# EAGLE design air-sense (EAGLE 8.4.0)
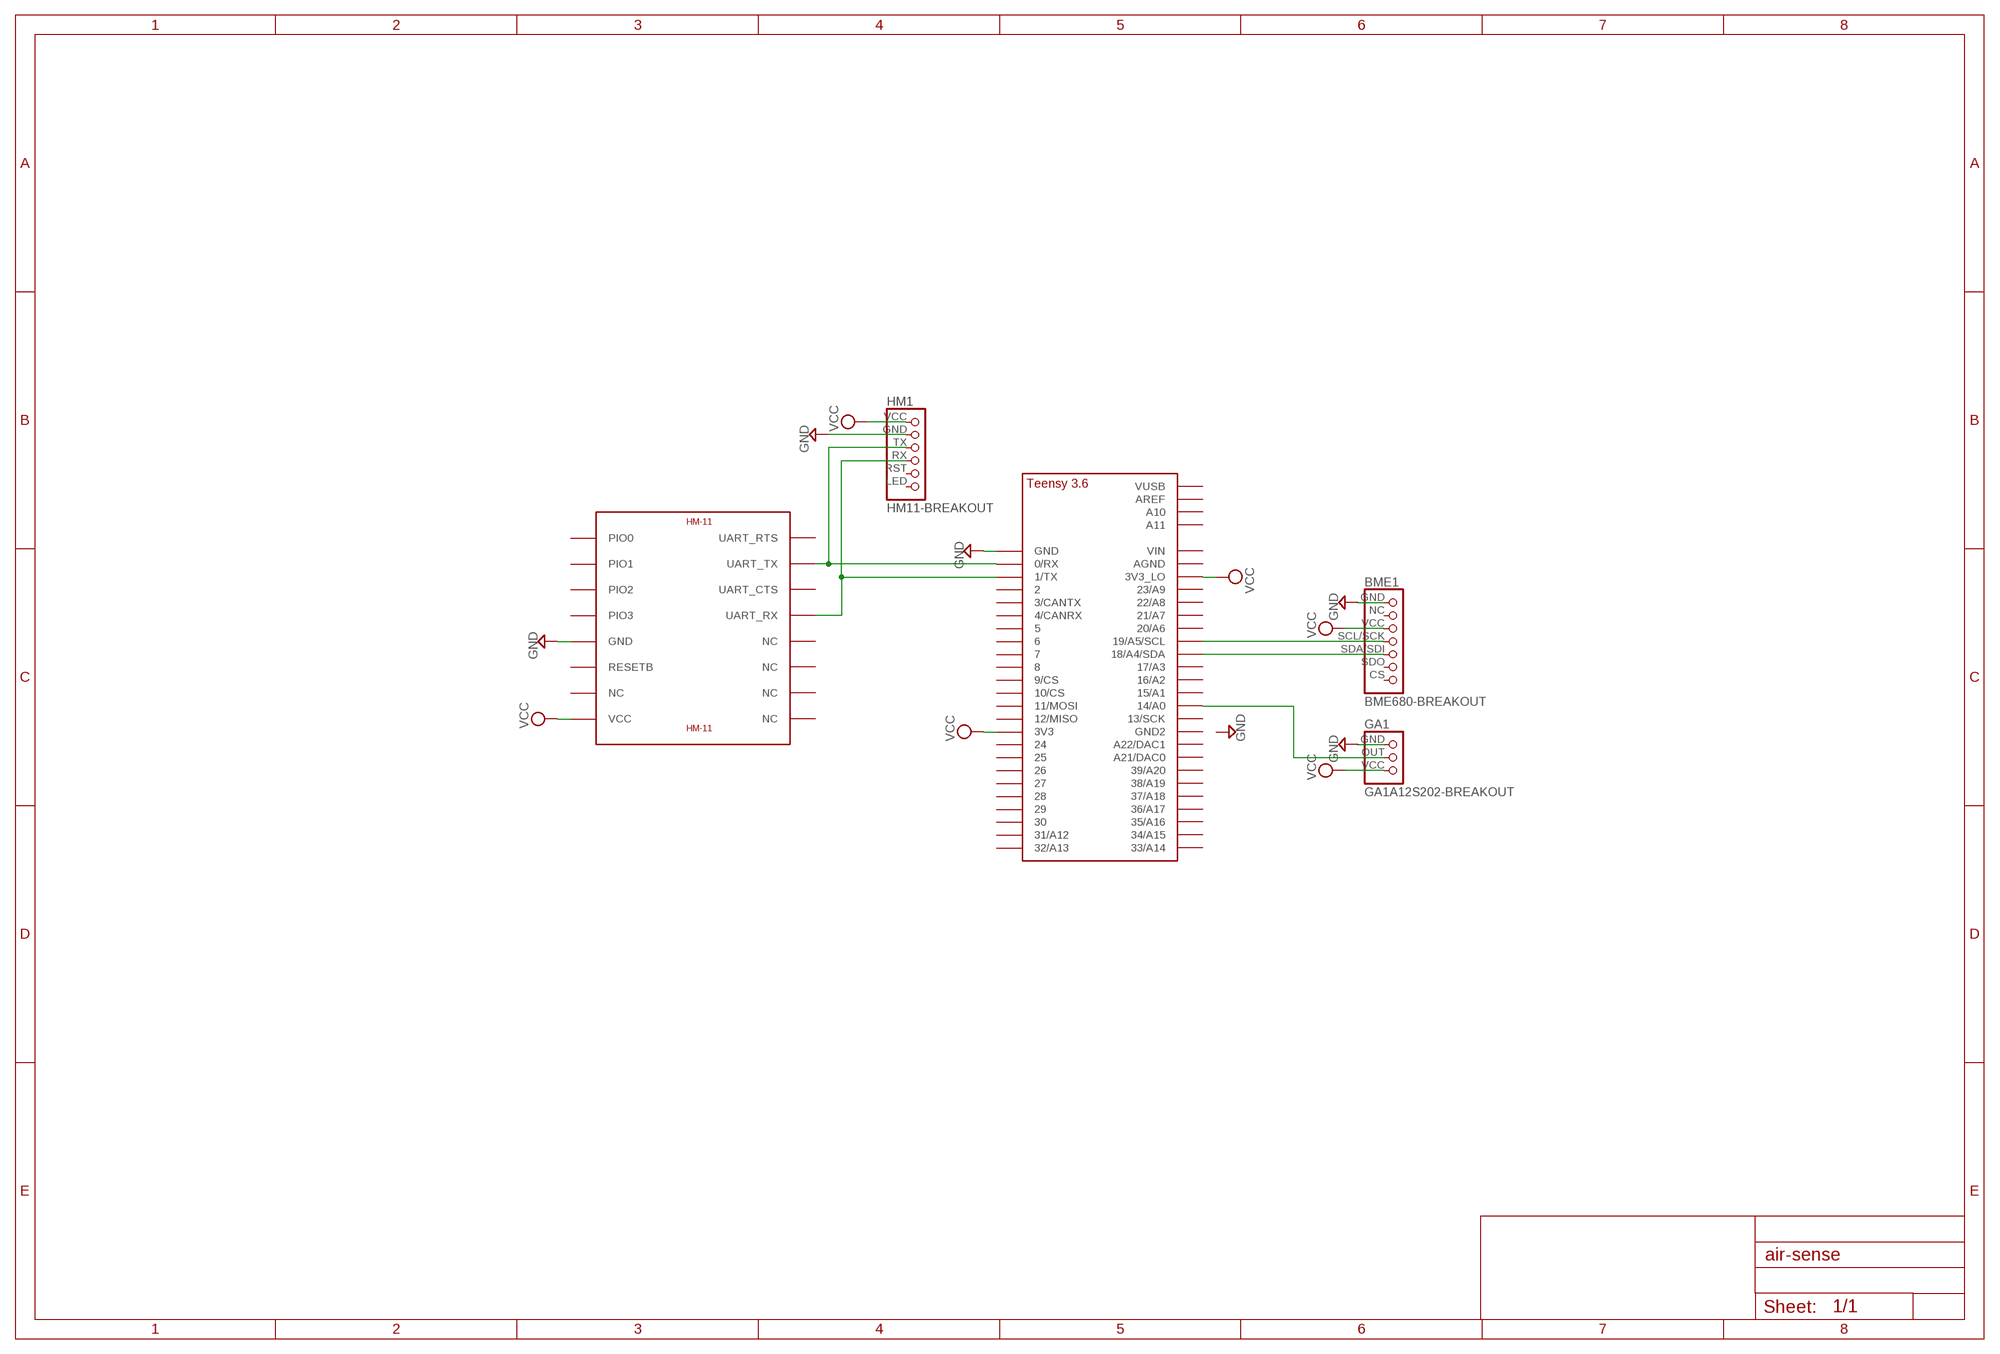
[diagram p0: schematic, sheet 1]

## Parts
BME1  BME680-BREAKOUT  [BME680-1X07]
GA1  GA1A12S202-BREAKOUT  [GA1A12S202-BREAKOUT]
HM1  HM11-BREAKOUT  [HM11-BREAKOUT]
U$1  TEENSY_3.5/3.6_BASIC  [TEENSY_3.5/3.6_BASIC]
U$2  HM-11  [HM-11]

## Nets
GND: BME1.GND GA1.GND HM1.GND U$1.GND U$2.GND
N$1: HM1.TX U$1.0/RX U$2.UART_TX
N$2: HM1.RX U$1.1/TX U$2.UART_RX
N$3: GA1.OUT U$1.14/A0
SCL: BME1.SCL/SCK U$1.19/A5/SCL
SDA: BME1.SDA/SDI U$1.18/A4/SDA
VCC: BME1.VCC GA1.VCC HM1.VCC U$1.3V3 U$1.3V3_LO U$2.VCC
Unconnected: BME1.CS BME1.NC BME1.SDO HM1.LED HM1.RST U$1.2 U$1.3/CANTX U$1.4/CANRX U$1.5 U$1.6 U$1.7 U$1.8 U$1.9/CS U$1.10/CS U$1.11/MOSI U$1.12/MISO U$1.13/SCK U$1.15/A1 U$1.16/A2 U$1.17/A3 U$1.20/A6 U$1.21/A7 U$1.21/DAC0(A21/DAC0) U$1.22/A8 U$1.23/A9 U$1.24 U$1.25 U$1.26 U$1.27 U$1.28 U$1.29 U$1.30 U$1.31/A12 U$1.32/A13 U$1.33/A14 U$1.34/A15 U$1.35/A16 U$1.36/A17 U$1.37/A18 U$1.38/A19 U$1.39/A20 U$1.A10 U$1.A11 U$1.A22/DAC1 U$1.AGND U$1.AREF U$1.GND2 U$1.VIN U$1.VUSB U$2.NC@5(NC) U$2.NC@6(NC) U$2.NC@7(NC) U$2.NC@8(NC) U$2.NC@10(NC) U$2.PIO0 U$2.PIO1 U$2.PIO2 U$2.PIO3 U$2.RESETB U$2.UART_CTS U$2.UART_RTS

## Library data of the parts
BME1 = AQ-Parts:BME680-BREAKOUT: http://www.watterott.com/en/BME680-Breakout
GA1 = AQ-Parts:GA1A12S202-BREAKOUT
HM1 = AQ-Parts:HM11-BREAKOUT
U$1 = Teensy356:TEENSY_3.5/3.6_BASIC
U$2 = smartwatch-hm11:HM-11: JNHuaMao HM-11 Bluetooth 4.0 Transceiver based on TI CC2540/CC2541

## Net classes
0 default: width 0.406 mm, drill 0.8 mm, clearance 0.406 mm

## Board
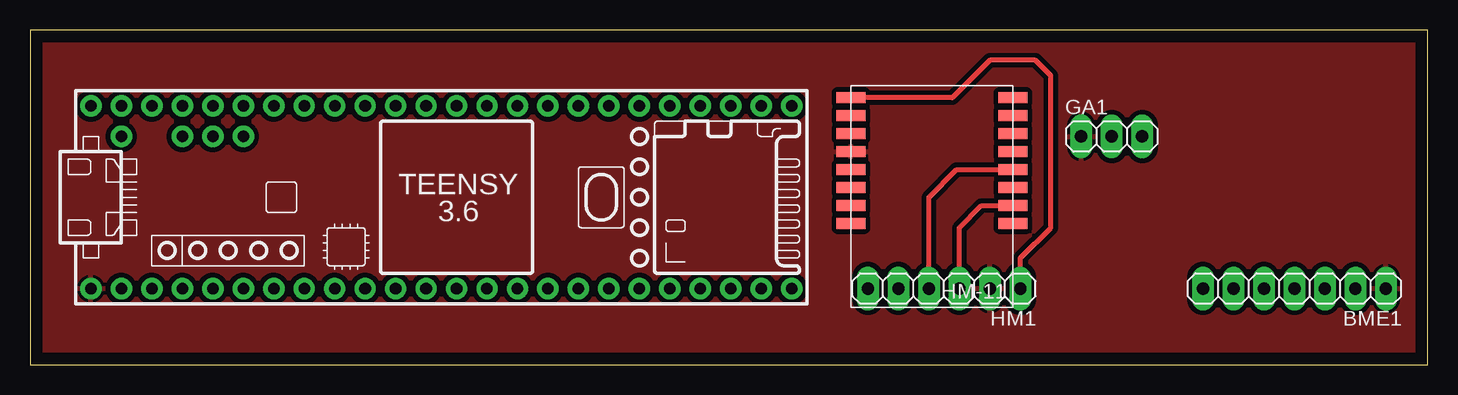
[diagram p1: board, top side]
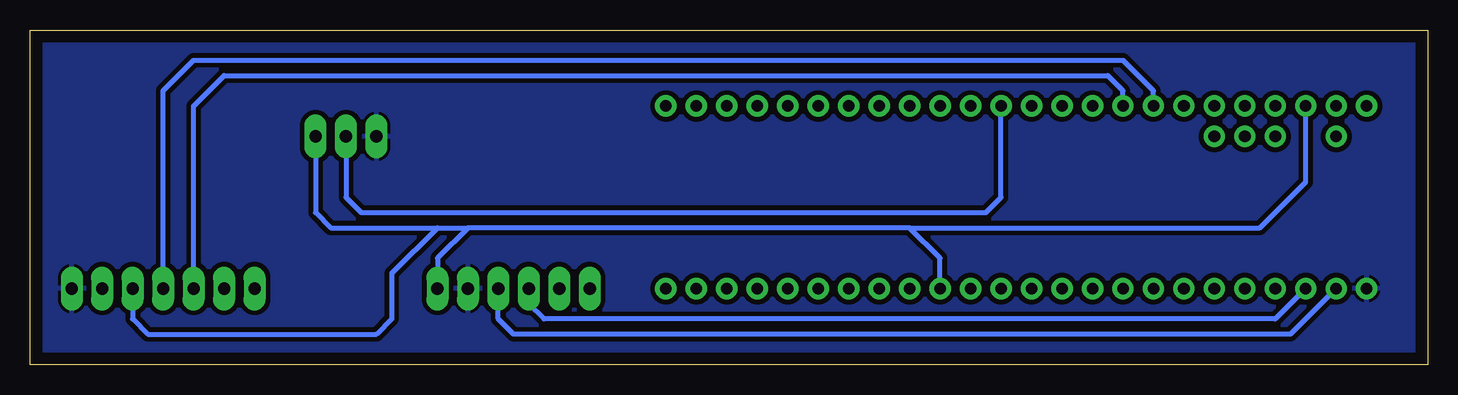
[diagram p2: board, bottom side, seen from below]

Size 116.51 x 27.93 mm. Coordinates in mm from the lower left corner, seen from the top.
Outline: 0,0 116.51,0 116.51,27.93 0,27.93 0,0
Copper layers (1*16): Top 0.035mm / dielectric 1.5mm / Bottom 0.035mm
Design rules "makerspace": minimum track width 8mil, minimum drill 16mil, track to track 8mil, track to pad 8mil, pad to pad 8mil, via to via 8mil, smd to smd 8mil, copper to edge 40mil, drill to drill 8mil, minimum pad ring 16mil, minimum via ring 8mil, stop-mask expansion 4mil, vias tented up to drill 0mil, thermal gap 10mil

### Footprints (pad centres in the part's own frame; a part is rotated, then mirrored left to right if it is on the bottom)
BME680-1X07 = drill 1.016 long: CS 7.62,0; GND -7.62,0; NC -5.08,0; SCL/SCK 0,0; SDA/SDI 2.54,0; SDO 5.08,0; VCC -2.54,0
GA1A12S202-BREAKOUT = drill 1.016 long: GND -2.54,0; OUT 0,0; VCC 2.54,0
HM11-BREAKOUT = drill 1.016 long: GND -3.81,0; LED 6.35,0; RST 3.81,0; RX 1.27,0; TX -1.27,0; VCC -6.35,0
TEENSY_3.5/3.6_BASIC = drill 0.965: 0/RX -25.4,-7.62; 1/TX -22.86,-7.62; 2 -20.32,-7.62; 3/CANTX -17.78,-7.62; 3V3 7.62,-7.62; 3V3_LO -22.86,7.62; 4/CANRX -15.24,-7.62; 5 -12.7,-7.62; 6 -10.16,-7.62; 7 -7.62,-7.62; 8 -5.08,-7.62; 9/CS -2.54,-7.62; 10/CS 0,-7.62; 11/MOSI 2.54,-7.62; 12/MISO 5.08,-7.62; 13/SCK 5.08,7.62; 14/A0 2.54,7.62; 15/A1 0,7.62; 16/A2 -2.54,7.62; 17/A3 -5.08,7.62; 18/A4/SDA -7.62,7.62; 19/A5/SCL -10.16,7.62; 20/A6 -12.7,7.62; 21/A7 -15.24,7.62; 21/DAC0 12.7,7.62; 22/A8 -17.78,7.62; 23/A9 -20.32,7.62; 24 10.16,-7.62; 25 12.7,-7.62; 26 15.24,-7.62; 27 17.78,-7.62; 28 20.32,-7.62; 29 22.86,-7.62; 30 25.4,-7.62; 31/A12 27.94,-7.62; 32/A13 30.48,-7.62; 33/A14 30.48,7.62; 34/A15 27.94,7.62; 35/A16 25.4,7.62; 36/A17 22.86,7.62; 37/A18 20.32,7.62; 38/A19 17.78,7.62; 39/A20 15.24,7.62; A10 -17.78,5.08; A11 -15.24,5.08; A22/DAC1 10.16,7.62; AGND -25.4,7.62; AREF -20.32,5.08; GND -27.94,-7.62; GND2 7.62,7.62; VIN -27.94,7.62; VUSB -25.4,5.08
HM-11 = smd 2.4 x 0.9: GND 6.5,0; NC@5 -7,0; NC@6 -7,-1.5; NC@7 -7,-3; NC@8 -7,-4.5; NC@10 6.5,-3; PIO0 6.5,6; PIO1 6.5,4.5; PIO2 6.5,3; PIO3 6.5,1.5; RESETB 6.5,-1.5; UART_CTS -7,3; UART_RTS -7,6; UART_RX -7,1.5; UART_TX -7,4.5; VCC 6.5,-4.5

### Placement (x,y rotation side)
BME1  105.41,6.35 180 top
GA1  90.17,19.05 0 top
HM1  76.2,6.35 180 top
U$1  33.02,13.97 0 top
U$2  74.93,17.78 180 top

### Tracks (layer width: path | path; a pad name or v marks a point on that pad's centre or on a via)
GND
  pour Bottom: 0,27.94 116.84,27.94 116.84,0 0,0
  pour Top: 0,27.94 116.84,27.94 116.84,0 0,0
N$1
  Top 0.406: HM1.TX 77.47,11.43 79.32,13.28 U$2.UART_TX
  Bottom 0.406: U$1.0/RX 11.43,2.54 76.2,2.54 77.47,3.81 HM1.TX
N$2
  Top 0.406: HM1.RX 74.93,13.97 77.24,16.28 U$2.UART_RX
  Bottom 0.406: U$1.1/TX 12.7,3.81 73.66,3.81 74.93,5.08 HM1.RX
N$3
  Bottom 0.406: U$1.14/A0 35.56,13.97 36.83,12.7 88.9,12.7 90.17,13.97 GA1.OUT
SCL
  Bottom 0.406: U$1.19/A5/SCL 22.86,22.86 25.4,25.4 102.87,25.4 105.41,22.86 BME1.SCL/SCK
SDA
  Bottom 0.406: U$1.18/A4/SDA 25.4,22.86 26.67,24.13 100.33,24.13 102.87,21.59 BME1.SDA/SDI
VCC
  Top 0.406: HM1.VCC 82.55,8.89 85.09,11.43 85.09,24.13 83.82,25.4 80.01,25.4 76.89,22.28 U$2.VCC
  Bottom 0.406: 43.18,11.43 80.01,11.43 | 43.18,11.43 13.97,11.43 10.16,15.24 U$1.3V3_LO | U$1.3V3 40.64,8.89 43.18,11.43 | 80.01,11.43 82.55,8.89 HM1.VCC | 82.55,11.43 91.44,11.43 92.71,12.7 GA1.VCC | 82.55,11.43 80.01,11.43 | 82.55,11.43 86.36,7.62 86.36,3.81 87.63,2.54 106.68,2.54 107.95,3.81 BME1.VCC